# EAGLE design adv_timer (EAGLE 9.6.0)
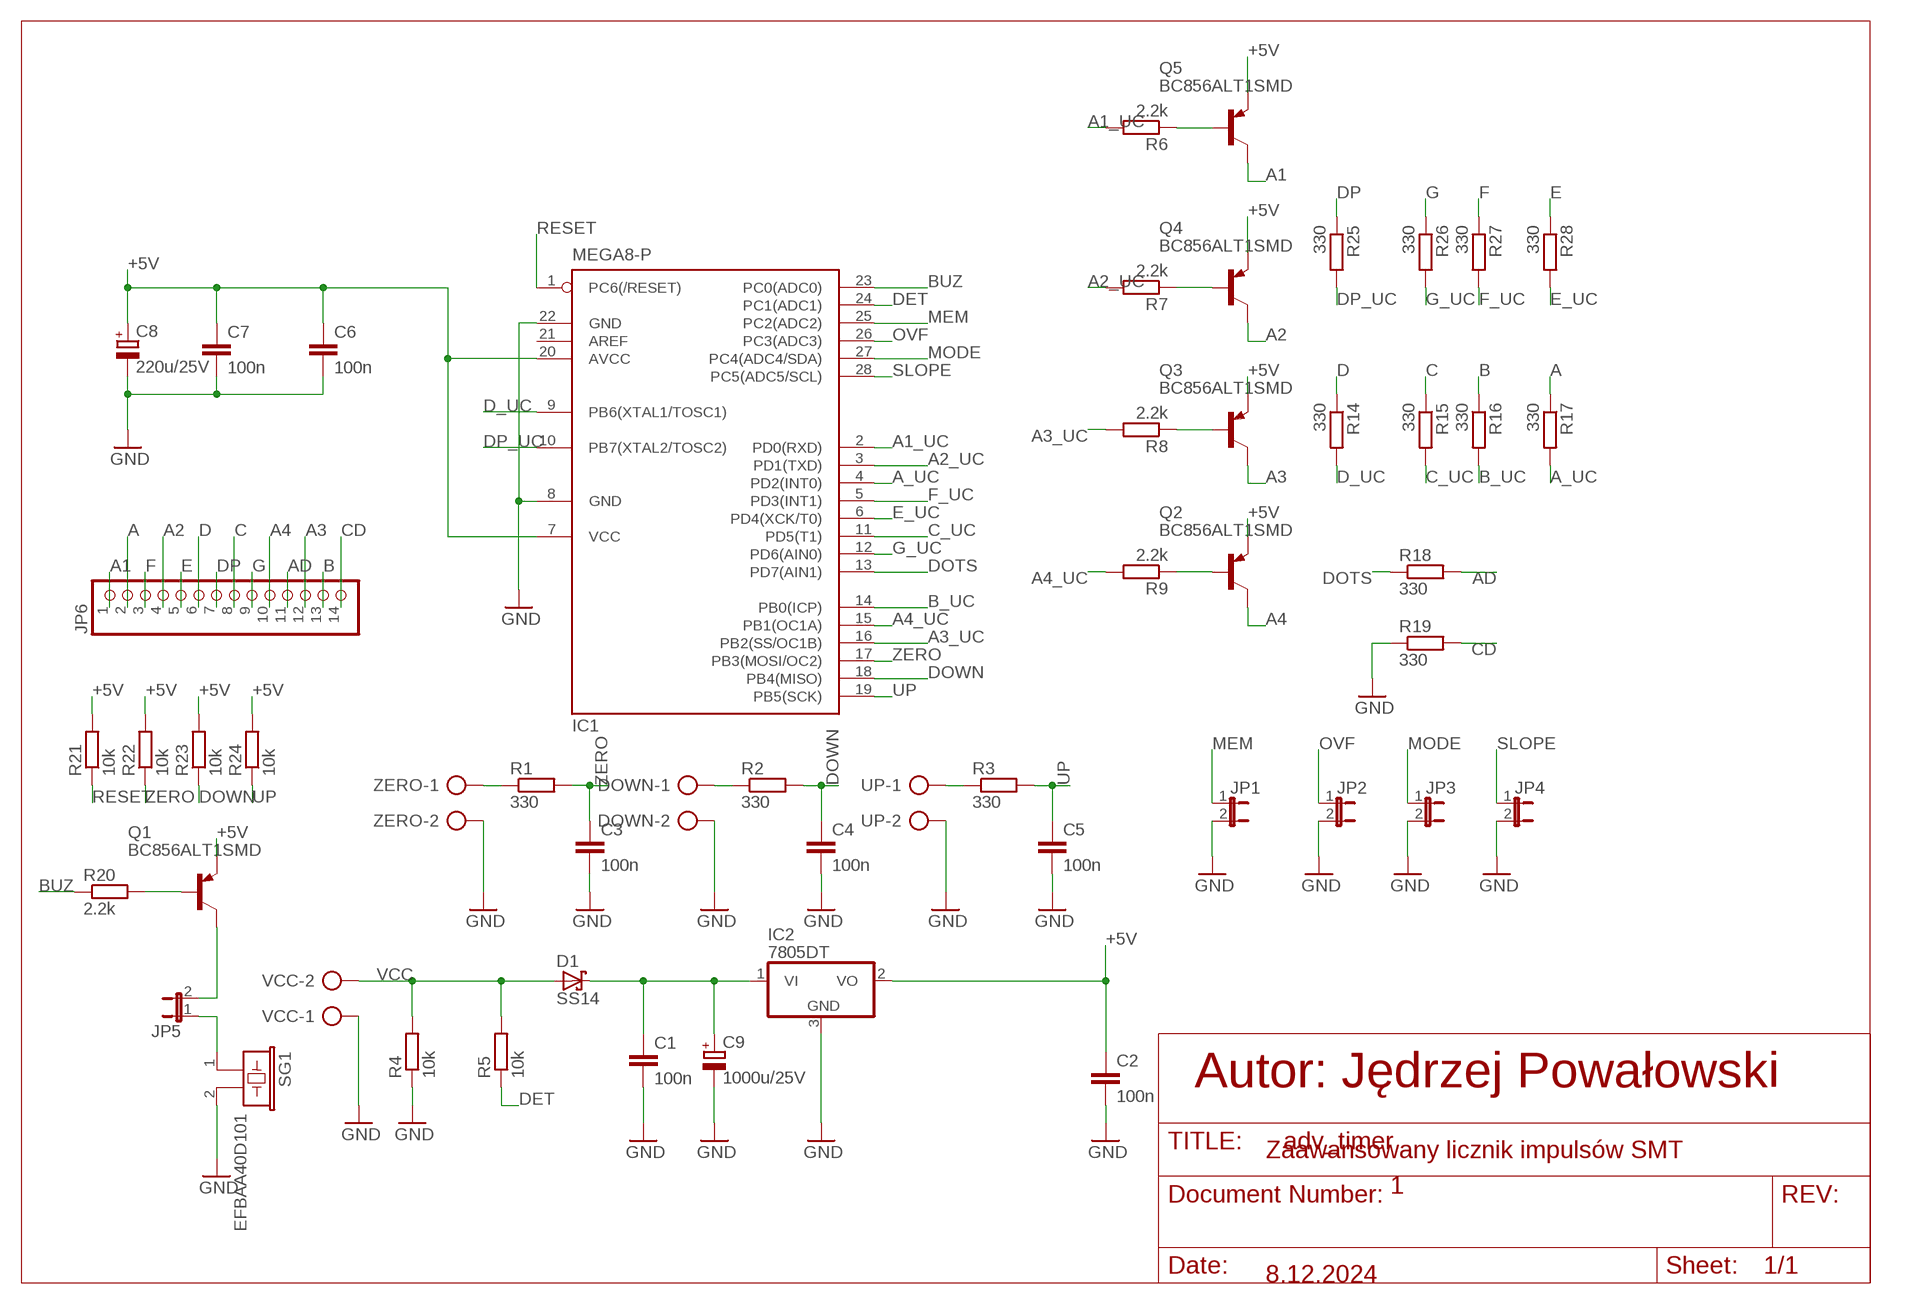
[diagram p0: schematic, sheet 1]

## Parts
C1  100n  C-EUC1210K  [C1210K]
C2  100n  C-EUC1210K  [C1210K]
C3  100n  C-EUC1210K  [C1210K]
C4  100n  C-EUC1210K  [C1210K]
C5  100n  C-EUC1210K  [C1210K]
C6  100n  C-EUC1210K  [C1210K]
C7  100n  C-EUC1210K  [C1210K]
C8  220u/25V  CPOL-EU153CLV-0810  [153CLV-0810]
C9  1000u/25V  CPOL-EU153CLV-0810  [153CLV-0810]
D1  SS14  [DO-214AC]
DOWN  AK300/2  [AK300/2]
IC1  MEGA8-P  [DIL28-3]
IC2  7805DT  [TO252]
JP1  JP1E  [JP1]
JP2  JP1E  [JP1]
JP3  JP1E  [JP1]
JP4  JP1E  [JP1]
JP5  JP1E  [JP1]
JP6  PINHD-1X14/90  [1X14/90]
Q1  BC856ALT1SMD  [SOT23-BEC]
Q2  BC856ALT1SMD  [SOT23-BEC]
Q3  BC856ALT1SMD  [SOT23-BEC]
Q4  BC856ALT1SMD  [SOT23-BEC]
Q5  BC856ALT1SMD  [SOT23-BEC]
R1  330  R-EU_M1206  [M1206]
R2  330  R-EU_M1206  [M1206]
R3  330  R-EU_M1206  [M1206]
R4  10k  R-EU_M1206  [M1206]
R5  10k  R-EU_M1206  [M1206]
R6  2.2k  R-EU_R0805  [R0805]
R7  2.2k  R-EU_R0805  [R0805]
R8  2.2k  R-EU_R0805  [R0805]
R9  2.2k  R-EU_R0805  [R0805]
R14  330  R-EU_R0805  [R0805]
R15  330  R-EU_R0805  [R0805]
R16  330  R-EU_R0805  [R0805]
R17  330  R-EU_R0805  [R0805]
R18  330  R-EU_R0805  [R0805]
R19  330  R-EU_R0805  [R0805]
R20  2.2k  R-EU_R0805  [R0805]
R21  10k  R-EU_R0805  [R0805]
R22  10k  R-EU_R0805  [R0805]
R23  10k  R-EU_R0805  [R0805]
R24  10k  R-EU_R0805  [R0805]
R25  330  R-EU_R0805  [R0805]
R26  330  R-EU_R0805  [R0805]
R27  330  R-EU_R0805  [R0805]
R28  330  R-EU_R0805  [R0805]
SG1  EFBAA40D101  [EFBAA40D101]
UP  AK300/2  [AK300/2]
VCC  AK300/2  [AK300/2]
ZERO  AK300/2  [AK300/2]

## Nets
+5V: C2.1 C6.1 C7.1 C8.+ IC1.7(VCC) IC1.20(AVCC) IC2.2(VO) Q1.E Q2.E Q3.E Q4.E Q5.E R21.2 R22.2 R23.2 R24.2
A: JP6.2 R17.1
A1: JP6.1 Q5.C
A1_UC: IC1.2(PD0(RXD)) R6.2
A2: JP6.4 Q4.C
A2_UC: IC1.3(PD1(TXD)) R7.2
A3: JP6.12 Q3.C
A3_UC: IC1.16(PB2(SS/OC1B)) R8.2
A4: JP6.10 Q2.C
A4_UC: IC1.15(PB1(OC1A)) R9.2
A_UC: IC1.4(PD2(INT0)) R17.2
AD: JP6.11 R18.2
B: JP6.13 R16.1
B_UC: IC1.14(PB0(ICP)) R16.2
BUZ: IC1.23(PC0(ADC0)) R20.1
C: JP6.8 R15.1
C_UC: IC1.11(PD5(T1)) R15.2
CD: JP6.14 R19.2
D: JP6.6 R14.1
D_UC: IC1.9(PB6(XTAL1/TOSC1)) R14.2
DET: IC1.24(PC1(ADC1)) R5.1
DOTS: IC1.13(PD7(AIN1)) R18.1
DOWN: C4.1 IC1.18(PB4(MISO)) R2.2 R23.1
DP: JP6.7 R25.1
DP_UC: IC1.10(PB7(XTAL2/TOSC2)) R25.2
E: JP6.5 R28.1
E_UC: IC1.6(PD4(XCK/T0)) R28.2
F: JP6.3 R27.1
F_UC: IC1.5(PD3(INT1)) R27.2
G: JP6.9 R26.1
G_UC: IC1.12(PD6(AIN0)) R26.2
GND: C1.2 C2.2 C3.2 C4.2 C5.2 C6.2 C7.2 C8.- C9.- DOWN.2 IC1.8(GND) IC1.22(GND) IC2.3(GND) JP1.2 JP2.2 JP3.2 JP4.2 R4.1 R19.1 SG1.2 UP.2 VCC.1 ZERO.2
MEM: IC1.25(PC2(ADC2)) JP1.1
MODE: IC1.27(PC4(ADC4/SDA)) JP3.1
N$2: Q2.B R9.1
N$5: Q3.B R8.1
N$6: Q4.B R7.1
N$8: Q1.B R20.2
N$9: Q5.B R6.1
N$25: C1.1 C9.+ D1.K IC2.1(VI)
N$49: JP5.2 Q1.C
N$50: JP5.1 SG1.1
N$58: R1.1 ZERO.1
N$60: DOWN.1 R2.1
N$62: R3.1 UP.1
OVF: IC1.26(PC3(ADC3)) JP2.1
RESET: IC1.1(PC6(/RESET)) R21.1
SLOPE: IC1.28(PC5(ADC5/SCL)) JP4.1
UP: C5.1 IC1.19(PB5(SCK)) R3.2 R24.1
VCC: D1.A R4.2 R5.2 VCC.2
ZERO: C3.1 IC1.17(PB3(MOSI/OC2)) R1.2 R22.1
Unconnected: IC1.21(AREF)

## Notes on the sheet
- Autor: Jędrzej Powałowski
- Zaawansowany licznik impulsów SMT
- 1
- 8.12.2024

## Library data of the parts
C1-C7 = rcl:C-EU: CAPACITOR, European symbol; SPICEPREFIX: C
C8 C9 = rcl:CPOL-EU: POLARIZED CAPACITOR, European symbol; SPICEPREFIX: C
D1 = SS14:SS14: Diodo de barrera Schottky (1N5819 SMD) (VRRM): 40V, IRMS: 1A Check availability <https://pricing.snapeda.com/parts/SS14/onsemi/view-part?ref=eda>; AVAILABILITY: In Stock; CHECK_PRICES: https://www.snapeda.com/parts/SS14/Onsemi/view-part/?ref=eda; DESCRIPTION: Diode Schottky 40 V 1A Surface Mount DO-214AC (SMA); MF: onsemi; MP: SS14; PACKAGE: SMA-2 ON Semiconductor; PRICE: None; SNAPEDA_LINK: https://www.snapeda.com/parts/SS14/Onsemi/view-part/?ref=snap
DOWN UP VCC ZERO = con-ptr500:AK300/2: CONNECTOR; OC_FARNELL: unknown; OC_NEWARK: unknown
IC1 = atmel:MEGA8-P: MICROCONTROLLER 8 Kbytes FLASH, 1 kbytes SRAM, 512 bytes EEPROM, USART, 4-channel 10 bit ADC, 2-channel 8 bit ADC Pin compatible with Atmega48, ATMega88, ATMega168 Source: avr.lbr; OC_FARNELL: unknown; OC_NEWARK: unknown
IC2 = linear:78*: Positive VOLTAGE REGULATOR Source: http://cache.national.com/ds/LM/LM78L05.pdf http://www.fairchildsemi.com/ds/LM/LM7805.pdf
JP1-JP5 = jumper:JP1E: JUMPER
JP6 = pinhead:PINHD-1X14: PIN HEADER
Q1-Q5 = transistor-pnp:BC856*: PNP Transistror
R1-R9 R14-R28 = rcl:R-EU_: RESISTOR, European symbol; SPICEPREFIX: R
SG1 = buzzer:EFB?: Piezoelectric Acoustic Transducer Source: Panbasonic .. 2SC1685.pdf; OC_FARNELL: unknown; OC_NEWARK: unknown

## Board
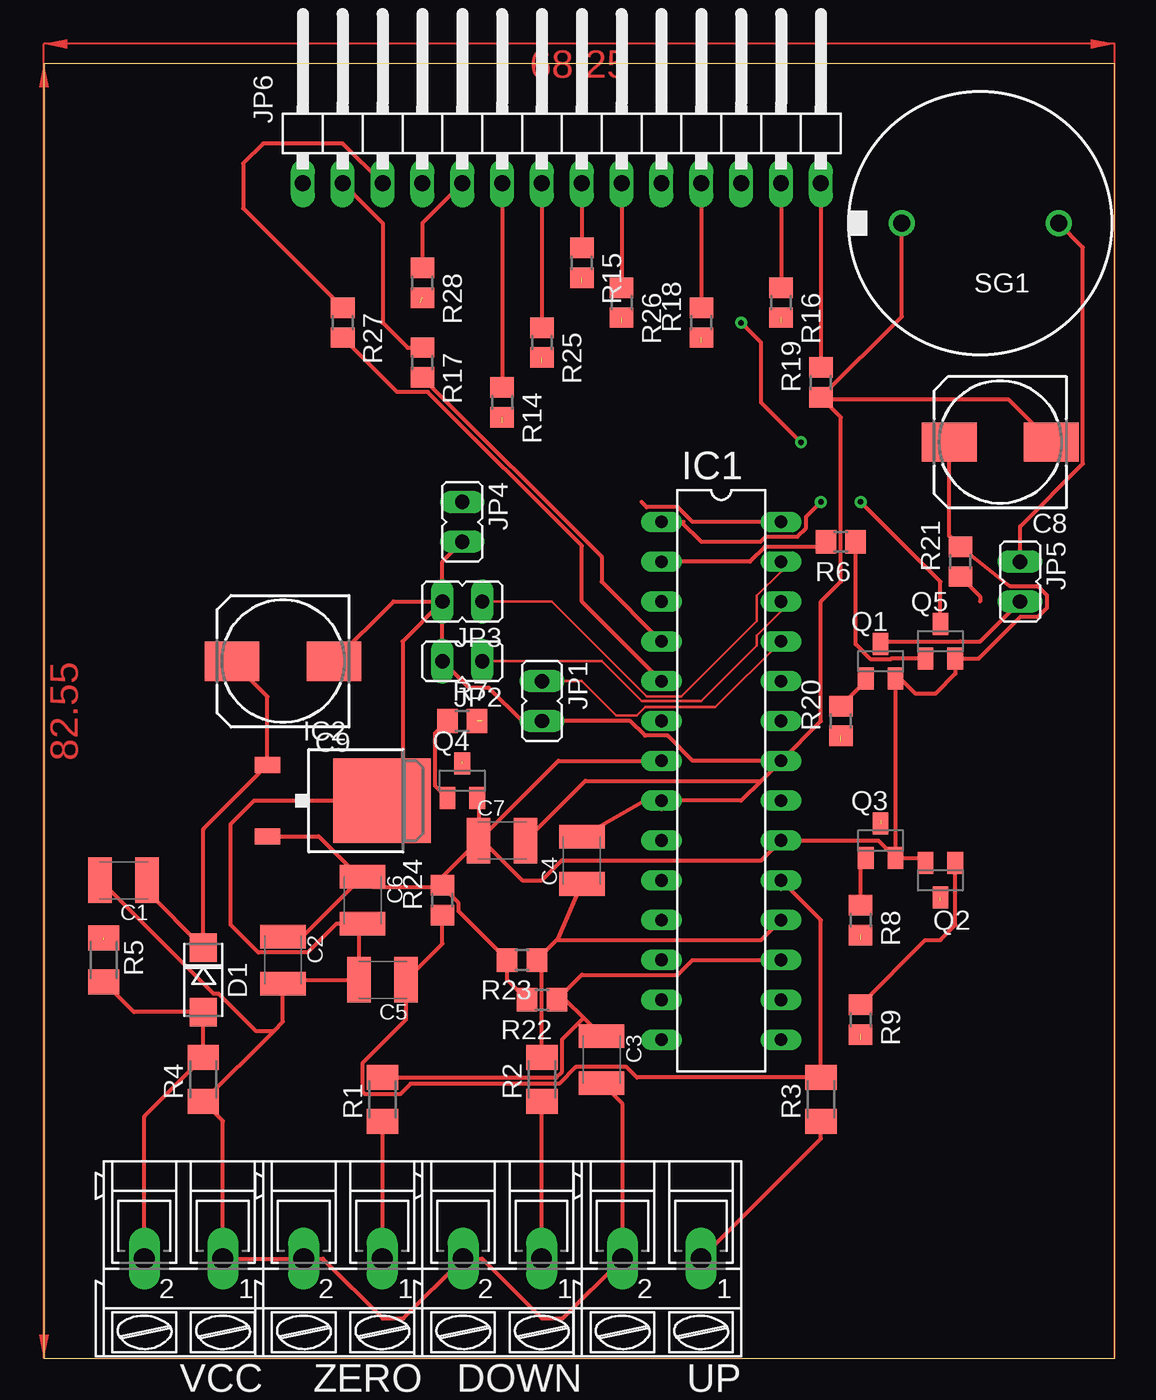
[diagram p1: board, top side]
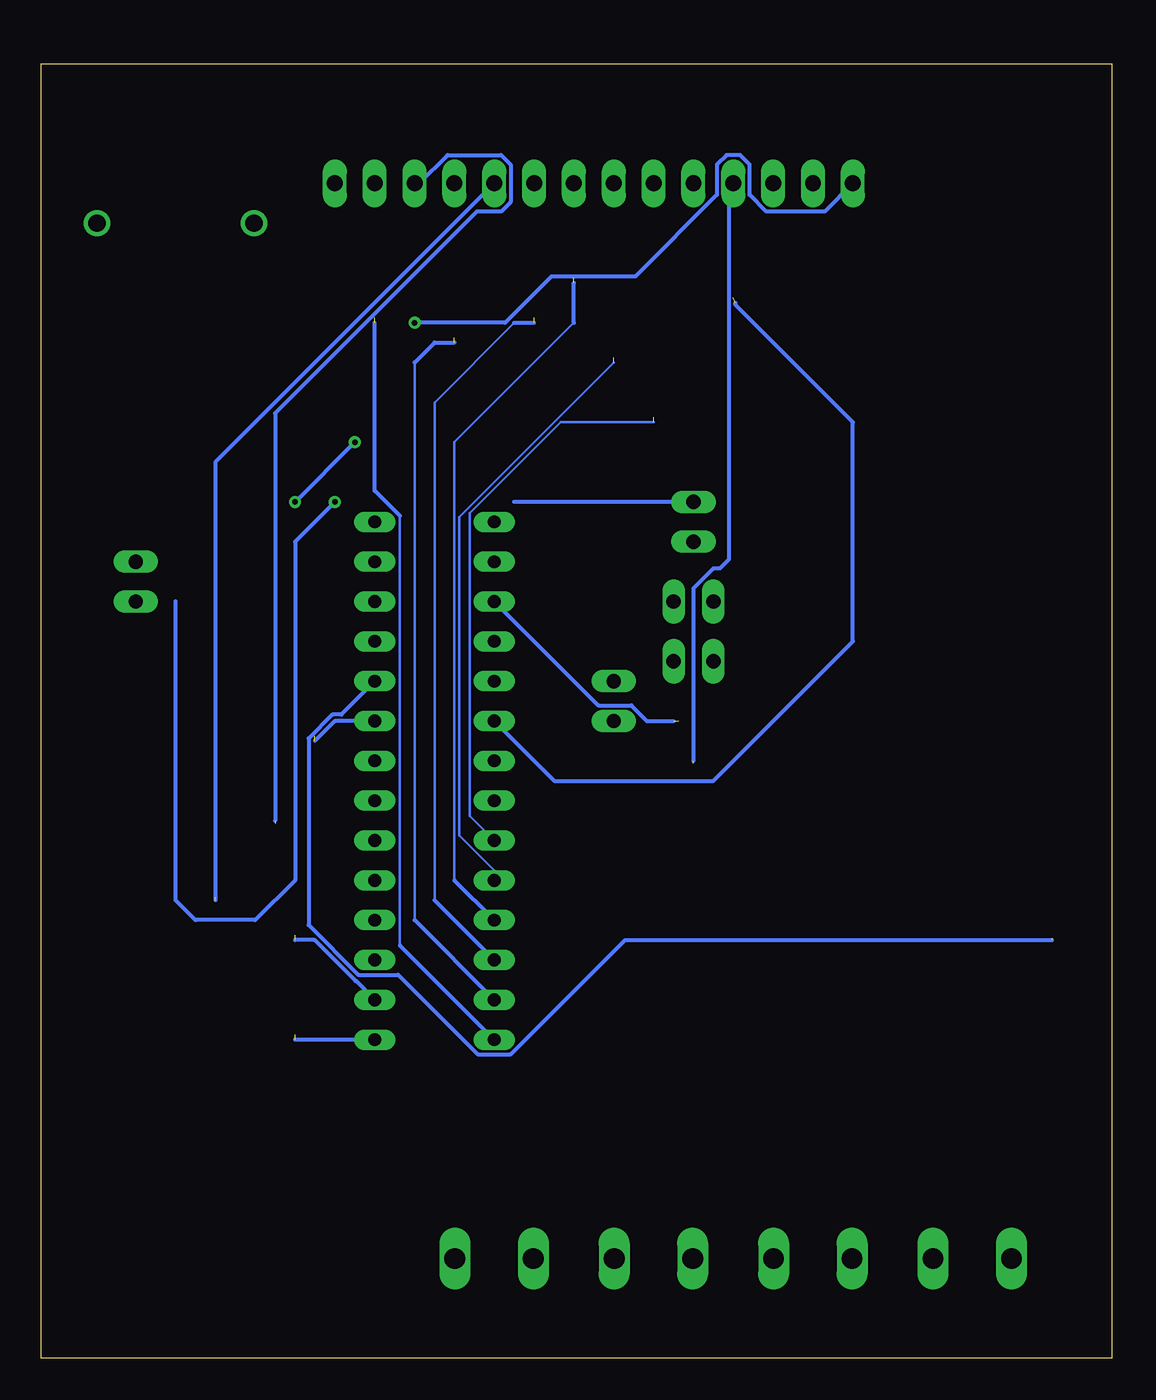
[diagram p2: board, bottom side, seen from below]

Size 68.25 x 82.55 mm. Coordinates in mm from the lower left corner, seen from the top.
Outline: 0,0 68.25,0 68.25,82.54 0,82.55 0,0
Copper layers (1*16): Top 0.035mm / dielectric 1.5mm / Bottom 0.035mm
Design rules "default": minimum track width 6mil, minimum drill 0.35mm, track to track 6mil, track to pad 6mil, pad to pad 6mil, via to via 6mil, smd to smd 6mil, copper to edge 40mil, drill to drill 6mil, minimum pad ring 10mil, minimum via ring 8mil, stop-mask expansion 4mil, vias tented up to drill 0mil, thermal gap 10mil

### Footprints (pad centres in the part's own frame; a part is rotated, then mirrored left to right if it is on the bottom)
C1210K = smd 1.5 x 2.9: 1 -1.5,0; 2 1.5,0
153CLV-0810 = smd 3.5 x 2.5: + 3.25,0; - -3.25,0
DO-214AC = smd 1.8 x 1.7: A 2.05,0; K -2.05,0
AK300/2 = drill 1.321 long: 1 -2.515,0; 2 2.489,0
DIL28-3 = drill 0.813 long: 1 -16.51,-3.81; 2 -13.97,-3.81; 3 -11.43,-3.81; 4 -8.89,-3.81; 5 -6.35,-3.81; 6 -3.81,-3.81; 7 -1.27,-3.81; 8 1.27,-3.81; 9 3.81,-3.81; 10 6.35,-3.81; 11 8.89,-3.81; 12 11.43,-3.81; 13 13.97,-3.81; 14 16.51,-3.81; 15 16.51,3.81; 16 13.97,3.81; 17 11.43,3.81; 18 8.89,3.81; 19 6.35,3.81; 20 3.81,3.81; 21 1.27,3.81; 22 -1.27,3.81; 23 -3.81,3.81; 24 -6.35,3.81; 25 -8.89,3.81; 26 -11.43,3.81; 27 -13.97,3.81; 28 -16.51,3.81
TO252 = smd 1 x 1.6: 1 -2.28,-4.8; 2 2.28,-4.8 | smd 5.4 x 6.2: 3 0,2.5
JP1 = drill 0.914 long: 1 0,-1.27; 2 0,1.27
1X14/90 = drill 1.016 long: 1 -16.51,-3.81; 2 -13.97,-3.81; 3 -11.43,-3.81; 4 -8.89,-3.81; 5 -6.35,-3.81; 6 -3.81,-3.81; 7 -1.27,-3.81; 8 1.27,-3.81; 9 3.81,-3.81; 10 6.35,-3.81; 11 8.89,-3.81; 12 11.43,-3.81; 13 13.97,-3.81; 14 16.51,-3.81
SOT23-BEC = smd 1 x 1.4: B -0.95,-1.1; C 0,1.1; E 0.95,-1.1
M1206 = smd 1.6 x 2: 1 -1.4,0; 2 1.4,0
R0805 = smd 1.3 x 1.5: 1 -0.95,0; 2 0.95,0
EFBAA40D101 = drill 1.1 pad 1.676: 1 -5,0; 2 5,0

### Placement (x,y rotation side)
C1  5.08,30.48 180 top
C2  15.24,25.4 270 top
C3  35.56,19.05 270 top
C4  34.29,31.75 90 top
C5  21.59,24.13 180 top
C6  20.32,29.21 270 top
C7  29.21,33.02 0 top
C8  60.96,58.42 180 top
C9  15.24,44.45 180 top
D1  10.16,24.13 270 top
DOWN  29.21,6.35 180 top
IC1  43.18,36.83 270 top
IC2  19.05,35.56 270 top
JP1  31.75,41.91 180 top
JP2  26.67,44.45 90 top
JP3  26.67,48.26 90 top
JP4  26.67,53.34 180 top
JP5  62.23,49.53 180 top
JP6  33.02,78.74 0 top
Q1  53.34,44.45 0 top
Q2  57.15,30.48 180 top
Q3  53.34,33.02 0 top
Q4  26.67,36.83 0 top
Q5  57.15,45.72 0 top
R1  21.59,16.51 90 top
R2  31.75,17.78 90 top
R3  49.53,16.51 90 top
R4  10.16,17.78 90 top
R5  3.81,25.4 270 top
R6  50.8,52.07 180 top
R7  26.67,40.64 0 top
R8  52.07,27.94 270 top
R9  52.07,21.59 270 top
R14  29.21,60.96 270 top
R15  34.29,69.85 270 top
R16  46.99,67.31 270 top
R17  24.13,63.5 270 top
R18  41.91,66.04 90 top
R19  49.53,62.23 90 top
R20  50.8,40.64 90 top
R21  58.42,50.8 90 top
R22  31.75,22.86 180 top
R23  30.48,25.4 180 top
R24  25.4,29.21 90 top
R25  31.75,64.77 270 top
R26  36.83,67.31 270 top
R27  19.05,66.04 270 top
R28  24.13,68.58 270 top
SG1  59.69,72.39 180 top
UP  39.37,6.35 180 top
VCC  8.89,6.35 180 top
ZERO  19.05,6.35 180 top

### Tracks (layer width: path | path; a pad name or v marks a point on that pad's centre or on a via)
+5V
  Top 0.254: C7.1 25.4,30.71 R24.2 25.4,30.05 | C7.1 32.79,38.1 IC1.7 | R22.2 29.53,24.13 R23.2 26.43,28.5 26.43,29.03 25.4,30.05 | C2.1 16.51,26.9 20.2,30.59 | 20.2,30.59 C6.1 20.98,30.05 25.4,30.05 | IC2.2 17.52,33.28 20.2,30.59 | C7.1 27.94,33.02 30.48,30.48 31.75,30.48 33.02,31.75 45.72,31.75 IC1.20 53.19,33.02 Q3.E | Q4.E 27.71,35.64 C7.1 | Q3.E 55.86,31.92 Q2.E | 62.23,47.27 63.35,47.27 63.93,47.85 63.93,48.67 63.35,49.25 61.56,49.25 R21.2 57.71,52.46 C8.+ | 62.23,47.27 62.21,47.27 | Q3.E Q1.E 54.6,43.35 55.58,42.37 56.82,42.37 58.1,43.66 Q5.E 59.58,44.62 62.23,47.27
A
  Top 0.254: JP6.2 21.59,72.39 21.59,66.04 23.18,64.45 R17.1
A1  (via drill 0.35)
  Top 0.254: Q5.C 57.15,49.53 v52.07,54.61 | v48.26,58.42 45.72,60.96 45.72,64.77 v44.45,66.04
  Bottom 0.254: JP6.1 18.31,73.13 22.02,73.13 23.09,74.19 23.09,76.12 23.7,76.73 24.56,76.73 25.17,76.12 25.17,74.19 30.38,68.99 35.73,68.99 38.68,66.04 v44.45,66.04 | v52.07,54.61 v48.26,58.42
A1_UC
  Top 0.254: R6.2 49.52,51.74 45.94,51.74 45,50.8 IC1.2
A2  (1 unrouted)
  Bottom 0.254: 26.67,38.1 26.67,49.1 25.4,50.37 24.99,50.37 24.41,50.95 24.41,74.65 JP6.4
A2_UC  (1 unrouted)
  Bottom 0.254: IC1.3 32.74,41.63 30.63,41.63 29.64,40.64 27.94,40.64
A3  (1 unrouted)
  Bottom 0.254: 53.34,34.29 53.34,60.27 40.48,73.13 38.94,73.13 38.33,73.74 38.33,76.12 38.94,76.73 42.34,76.73 44.15,74.93 JP6.12
A3_UC  (1 unrouted)
  Bottom 0.254: IC1.16 48.18,24.05 48.21,24.05 50.82,26.67 52.07,26.67
A4  (1 unrouted)
  Bottom 0.254: JP6.10 57.15,57.15 57.15,29.21
A4_UC  (1 unrouted)
  Bottom 0.254: IC1.15 52.07,20.32
A_UC
  Top 0.254: 24.13,62.23 R17.2 35.56,51.12 35.56,49.53 IC1.4
AD
  Top 0.254: JP6.11 R18.2
B
  Top 0.254: JP6.13 R16.1
B_UC  (1 unrouted)
  Bottom 0.152: 45.39,26.34 45.39,53.73
  Bottom 0.254: IC1.14 45.39,26.34 | 46.99,66.04 46.99,55.33 45.39,53.73
BUZ  (1 unrouted)
  Bottom 0.254: IC1.23 49.53,40.64 50.8,39.37
C
  Top 0.254: JP6.8 R15.1
C_UC  (1 unrouted)
  Bottom 0.152: 41.91,30.48 41.91,58.42 34.29,66.04
  Bottom 0.254: IC1.11 41.91,30.48 | 34.29,66.04 34.29,68.58
CD
  Top 0.254: JP6.14 R19.2
D
  Top 0.254: JP6.6 R14.1
D_UC  (1 unrouted)
  Bottom 0.152: IC1.9 40.92,34.57 40.92,53.9 35.13,59.69 29.21,59.69
DET  (1 unrouted)
  Bottom 0.254: IC1.24 49.12,41.05 49.7,41.05 51.21,39.54 51.21,27.63 48.04,24.46 45.5,24.46 40.42,19.38 38.32,19.38 31.03,26.67 3.81,26.67
DOTS  (1 unrouted)
  Bottom 0.152: 44.45,27.94 44.45,63.5
  Bottom 0.254: IC1.13 44.45,27.94 | 44.45,63.5 43.18,64.77 41.91,64.77
DOWN
  Top 0.254: 31.77,19.2 R2.2 31.75,25.08 | 31.77,25.06 31.75,25.08 | 31.75,25.08 R23.1 | R23.1 32.79,26.76 C4.1 | R23.1 32.7,26.67 45.72,26.67 IC1.18
DP
  Top 0.254: JP6.7 R25.1
DP_UC  (1 unrouted)
  Bottom 0.152: IC1.10 39.37,31.1 41.6,33.34 41.6,53.65 31.75,63.5
E
  Top 0.254: JP6.5 24.13,72.39 R28.1
E_UC  (1 unrouted)
  Bottom 0.254: IC1.6 35.56,36.83 25.4,36.83 16.51,45.72 16.51,59.69 24,67.18 24,67.31
F
  Top 0.254: JP6.3 19.05,77.47 13.97,77.47 12.7,76.2 12.7,73.34 R27.1
F_UC
  Top 0.254: 39.37,43.73 IC1.5 34.29,48.26 34.29,51.81 24.48,61.62 22.52,61.62 R27.2
G
  Top 0.254: JP6.9 R26.1
G_UC  (1 unrouted)
  Bottom 0.152: 43.18,29.21 43.18,60.96 38.1,66.04
  Bottom 0.254: IC1.12 43.18,29.21 | 38.1,66.04 36.83,66.04
GND
  Top 0.254: 14.67,20.89 R4.1 11.41,15.13 VCC.1 ZERO.2 17.78,6.35 21.59,2.54 22.91,2.54 DOWN.2 27.94,6.35 31.75,2.54 33.07,2.54 36.85,6.33 | 14.67,20.89 15.24,21.46 C2.2 15.47,24.13 C5.2 20.09,27.48 C6.2 18.65,27.71 16.81,25.87 13.67,25.87 11.9,27.64 11.9,34.06 13.4,35.56 IC2.3 | 20.05,34.06 IC2.3 | 36.85,6.33 UP.2 | C1.2 10.8,23.26 11.13,23.26 13.49,20.89 14.67,20.89 | IC1.22 45.72,36.83 | 45.72,36.83 44.45,35.56 IC1.8 | C7.2 34.52,36.83 45.72,36.83 | 39.37,35.01 IC1.8 | C3.2 36.85,16.25 36.85,6.33 | C4.2 38.33,35.56 IC1.8 | IC2.3 22.86,36.87 22.86,45.72 JP3.2 | IC1.22 49.53,40.64 49.53,48.26 50.8,49.53 50.8,60.01 49.69,61.12 | IC1.22 41.36,38.1 39.76,39.7 38.32,39.7 37.38,40.64 JP1.2 30.48,40.64 28.37,42.75 27.1,42.75 JP2.2 JP3.2 | JP3.2 22.3,48.26 C9.- | JP3.2 25.4,50.8 JP4.2 | 49.69,61.12 R19.1 54.69,66.44 SG1.2 | C8.- 61.51,61.12 49.69,61.12
MEM
  Top 0.152: JP1.1 34.29,43.18 36.47,41 37.81,41 38.34,41.53 40.64,41.53 42.8,41.53 IC1.25
MODE
  Top 0.152: JP3.1 32.37,48.26 38.42,42.22 40.64,42.22 45.44,47.02 45.44,48.63 46.99,50.18 IC1.27
N$2
  Top 0.254: R9.1 56.2,26.67 57.15,26.67 58.1,27.62 Q2.B
N$5
  Top 0.254: R8.1 52.07,30.48 52.07,31.6 Q3.B
N$6
  Top 0.254: Q4.B 24.93,36.52 24.93,39.85 R7.1
N$8
  Top 0.254: R20.2 52.39,43.18 Q1.B
N$9
  Top 0.254: Q5.B 54.01,44.62 53.96,44.57 52.72,44.57 51.75,45.55 R6.1
N$25
  Top 0.254: C1.1 6.58,29.76 D1.K 10.16,33.75 IC2.1 14.25,42.19 C9.+
N$49
  Top 0.254: Q1.C 53.51,45.72 58.42,45.72 59.69,45.72 JP5.2
N$50
  Top 0.254: JP5.1 62.23,53.05 66.24,57.05 66.24,70.84 SG1.1
N$58
  Top 0.254: ZERO.1 21.59,6.38 R1.1
N$60
  Top 0.254: DOWN.1 31.75,6.38 R2.1
N$62
  Top 0.254: UP.1 49.53,13.99 R3.1
OVF
  Top 0.152: JP2.1 35.56,44.45 38.1,41.91 41.91,41.91 45.44,45.44 45.44,46.09 46.99,47.64 IC1.26
RESET  (via drill 0.35)  (1 unrouted)
  Top 0.254: IC1.1 40.64,53.34 | 40.64,53.34 40.79,53.34 | 40.64,53.34 41.91,52.07 45.7,52.07 46.03,52.4 48.04,52.4 48.59,52.95 48.59,53.67 v49.53,54.61 | R21.1 59.69,48.58 59.69,48.26
  Bottom 0.254: v49.53,54.61 52.07,52.07 52.07,30.48 54.61,27.94 58.42,27.94 59.69,29.21 59.69,48.26
SLOPE  (1 unrouted)
  Top 0.254: 38.1,54.61 38.43,54.28 40.42,54.28 41.36,53.34 IC1.28
  Bottom 0.254: JP4.1 38.1,54.61
UP
  Top 0.254: R24.1 25.4,26.44 C5.1 23.09,21.61 20.31,18.83 20.31,16.99 20.47,16.83 22.71,16.83 23.38,17.5 32.84,17.5 33.92,18.58 37.13,18.58 37.79,17.91 R3.2 49.53,27.94 IC1.19 46.99,29.93
VCC
  Top 0.254: VCC.2 6.4,15.42 R4.2 D1.A 5.73,22.08 R5.2
ZERO
  Top 0.254: IC1.17 41.36,25.4 40.42,24.46 34.3,24.46 R22.1 33.25,22.86 34.4,21.7 | C3.1 34.4,21.7 | 34.4,21.7 33.03,20.33 33.03,18.26 32.68,17.91 R1.2
(copper drawn outside any net)
  shapes: Top area x2